# EAGLE schematic kegboard.rpt (EAGLE 6.2)
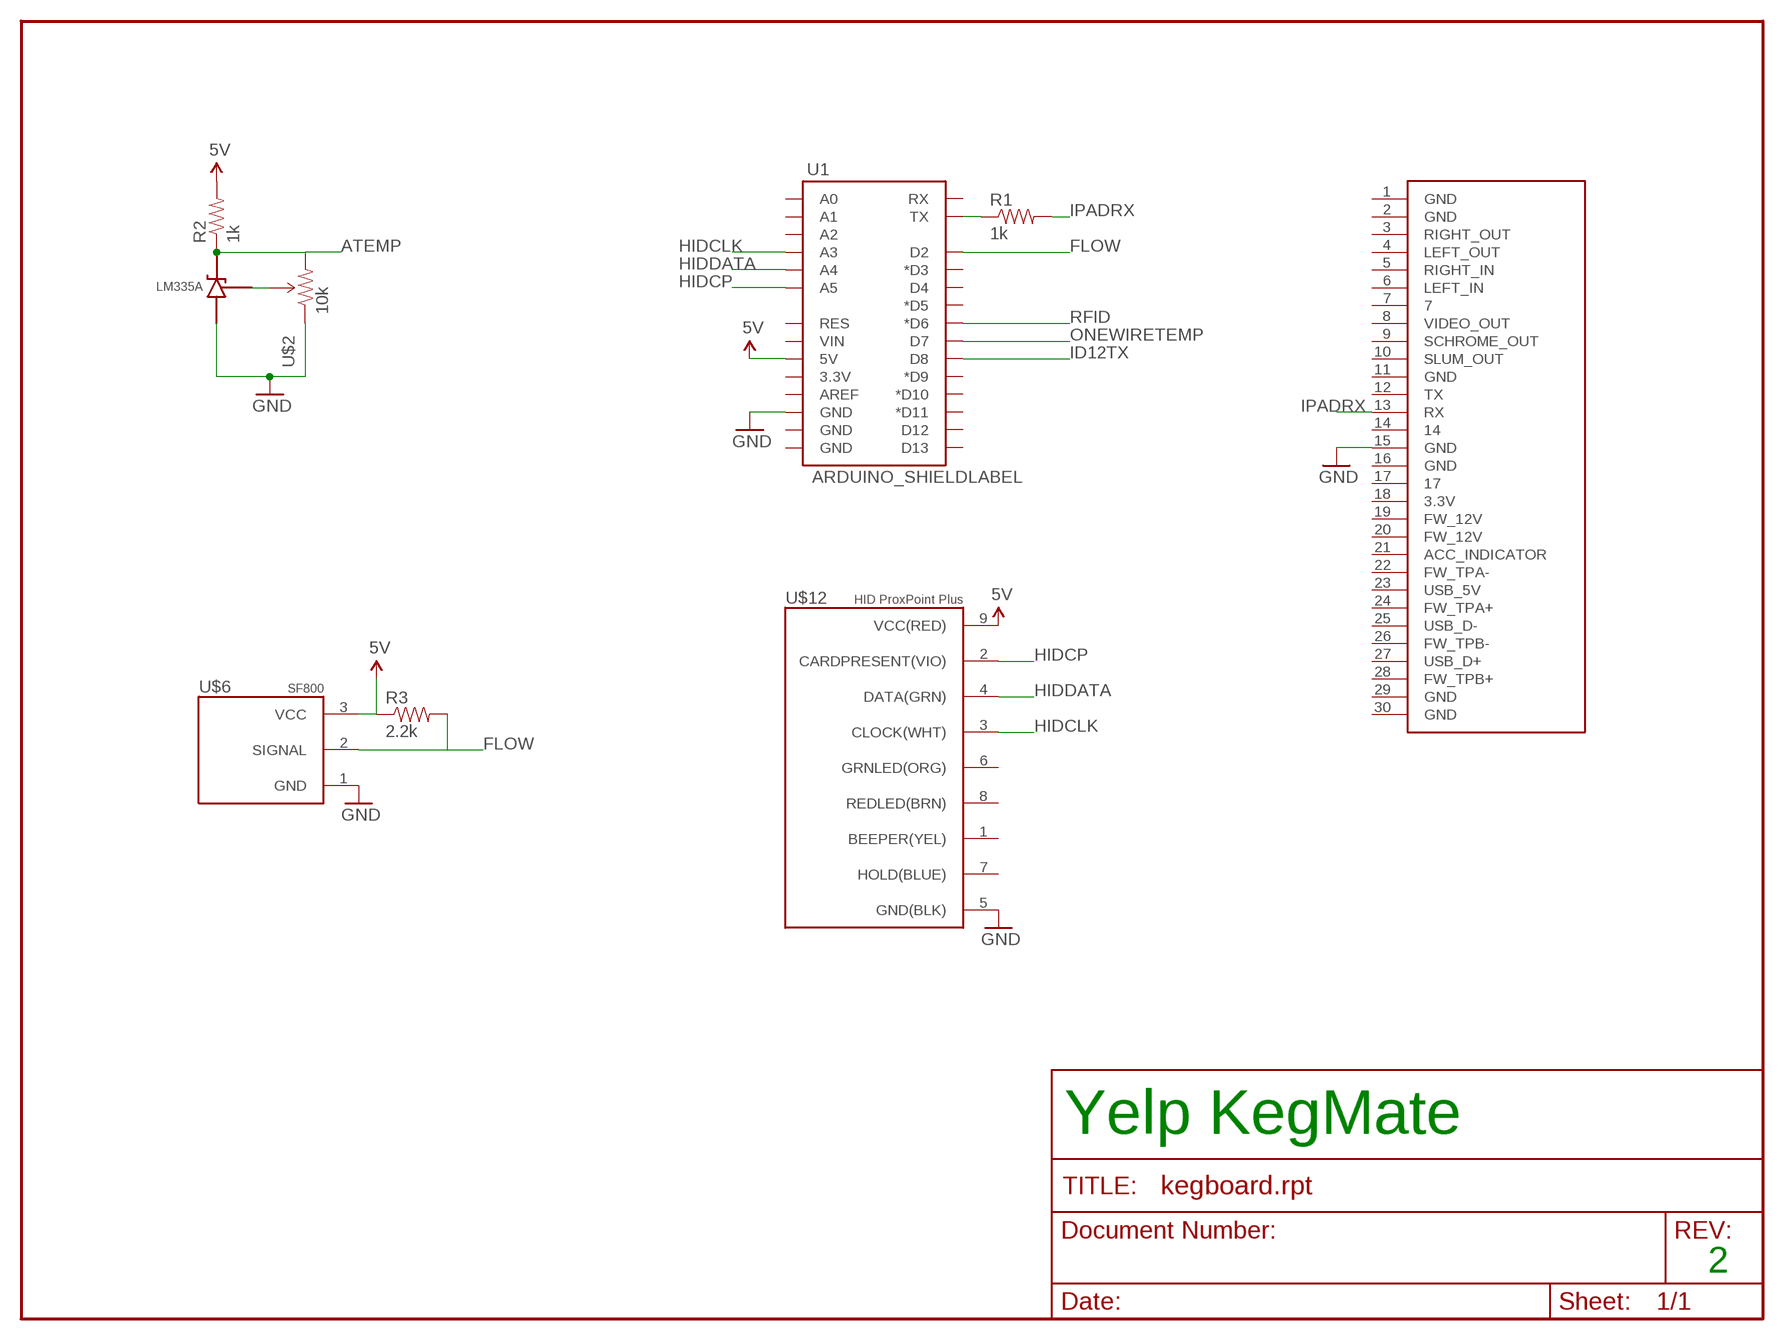
[diagram p0: schematic, sheet 1]

## Parts
R1  1k  RESISTORPTH1  [AXIAL-0.3]
R2  1k  RESISTORPTH1  [AXIAL-0.3]
R3  2.2k  RESISTORPTH1  [AXIAL-0.3]
U1  ARDUINO_SHIELDLABEL  [DUEMILANOVE_SHIELD]
U$1  IPOD_CONNECTOR_MALE  [IPOD_MALE_CONNECTOR]
U$2  10k  TRIMPOT  [3362U-2]
U$6  SF800  [1X03]
U$11  LM335A  [TO-92]
U$12  HIDPROXPOINT  [2X5]

## Nets
5V: R2.P$2 R3.P$1 U1.5V U$6.3(VCC) U$12.9(VCC(RED))
ATEMP: R2.P$1 U$2.3(CW) U$11.C1(+)
FLOW: R3.P$2 U1.D2 U$6.2(SIGNAL)
GND: U1.GND@2(GND) U$1.15(GND) U$2.1(CCW) U$6.1(GND) U$11.E1(-) U$12.5(GND(BLK))
HIDCLK: U1.A3 U$12.3(CLOCK(WHT))
HIDCP: U1.A5 U$12.2(CARDPRESENT(VIO))
HIDDATA: U1.A4 U$12.4(DATA(GRN))
ID12TX: U1.D8
IPADRX: R1.P$2 U$1.13(RX)
N$1: R1.P$1 U1.TX
N$2: U$2.2(WIPER) U$11.B1(ADJ)
ONEWIRETEMP: U1.D7
RFID: U1.D6(*D6)
Unconnected: U1.3.3V U1.A0 U1.A1 U1.A2 U1.AREF U1.D3(*D3) U1.D4 U1.D5(*D5) U1.D9(*D9) U1.D10(*D10) U1.D11(*D11) U1.D12 U1.D13 U1.GND@0(GND) U1.GND@1(GND) U1.RES U1.RX U1.VIN U$1.1(GND) U$1.2(GND) U$1.3(RIGHT_OUT) U$1.4(LEFT_OUT) U$1.5(RIGHT_IN) U$1.6(LEFT_IN) U$1.7 U$1.8(VIDEO_OUT) U$1.9(SCHROME_OUT) U$1.10(SLUM_OUT) U$1.11(GND) U$1.12(TX) U$1.14 U$1.16(GND) U$1.17 U$1.18(3.3V) U$1.19(FW_12V) U$1.20(FW_12V) U$1.21(ACC_INDICATOR) U$1.22(FW_TPA-) U$1.23(USB_5V) U$1.24(FW_TPA+) U$1.25(USB_D-) U$1.26(FW_TPB-) U$1.27(USB_D+) U$1.28(FW_TPB+) U$1.29(GND) U$1.30(GND) U$12.1(BEEPER(YEL)) U$12.6(GRNLED(ORG)) U$12.7(HOLD(BLUE)) U$12.8(REDLED(BRN))

## Notes on the sheet
- Yelp KegMate
- 2

## Library data of the parts
R1-R3 = SparkFun:RESISTOR: Resistor Basic schematic elements and footprints for 0603, 1206, and PTH 1/10th watt (small) resistors.
U1 = SparkFun:ARDUINO_SHIELD
U$1 = SparkFun:IPOD_CONNECTOR_MALE: iPod Male Connector This is the connector that will insert into an iPods. Use this connector to gain access to the various iPod pins. Schematic and footprint are not yet production proven. The PCB thickness must be more thin than the standard 0.062" FR4. Spark Fun Electronics SKU : DEV-00633
U$2 = SparkFun:TRIMPOT
U$6 = johnboiles:SF800: Swissflow SF800 Flow Meter
U$11 = johnboiles:LM335A: LM335A Analog Temperature Sensor
U$12 = johnboiles:HIDPROXPOINT: HID ProxPoint Plus RFID badge reader